# Altium schematic sheet BoardInterfaces_Soldier.SchDoc
size Tabloid; SheetNumber: 2; SheetTotal: 6
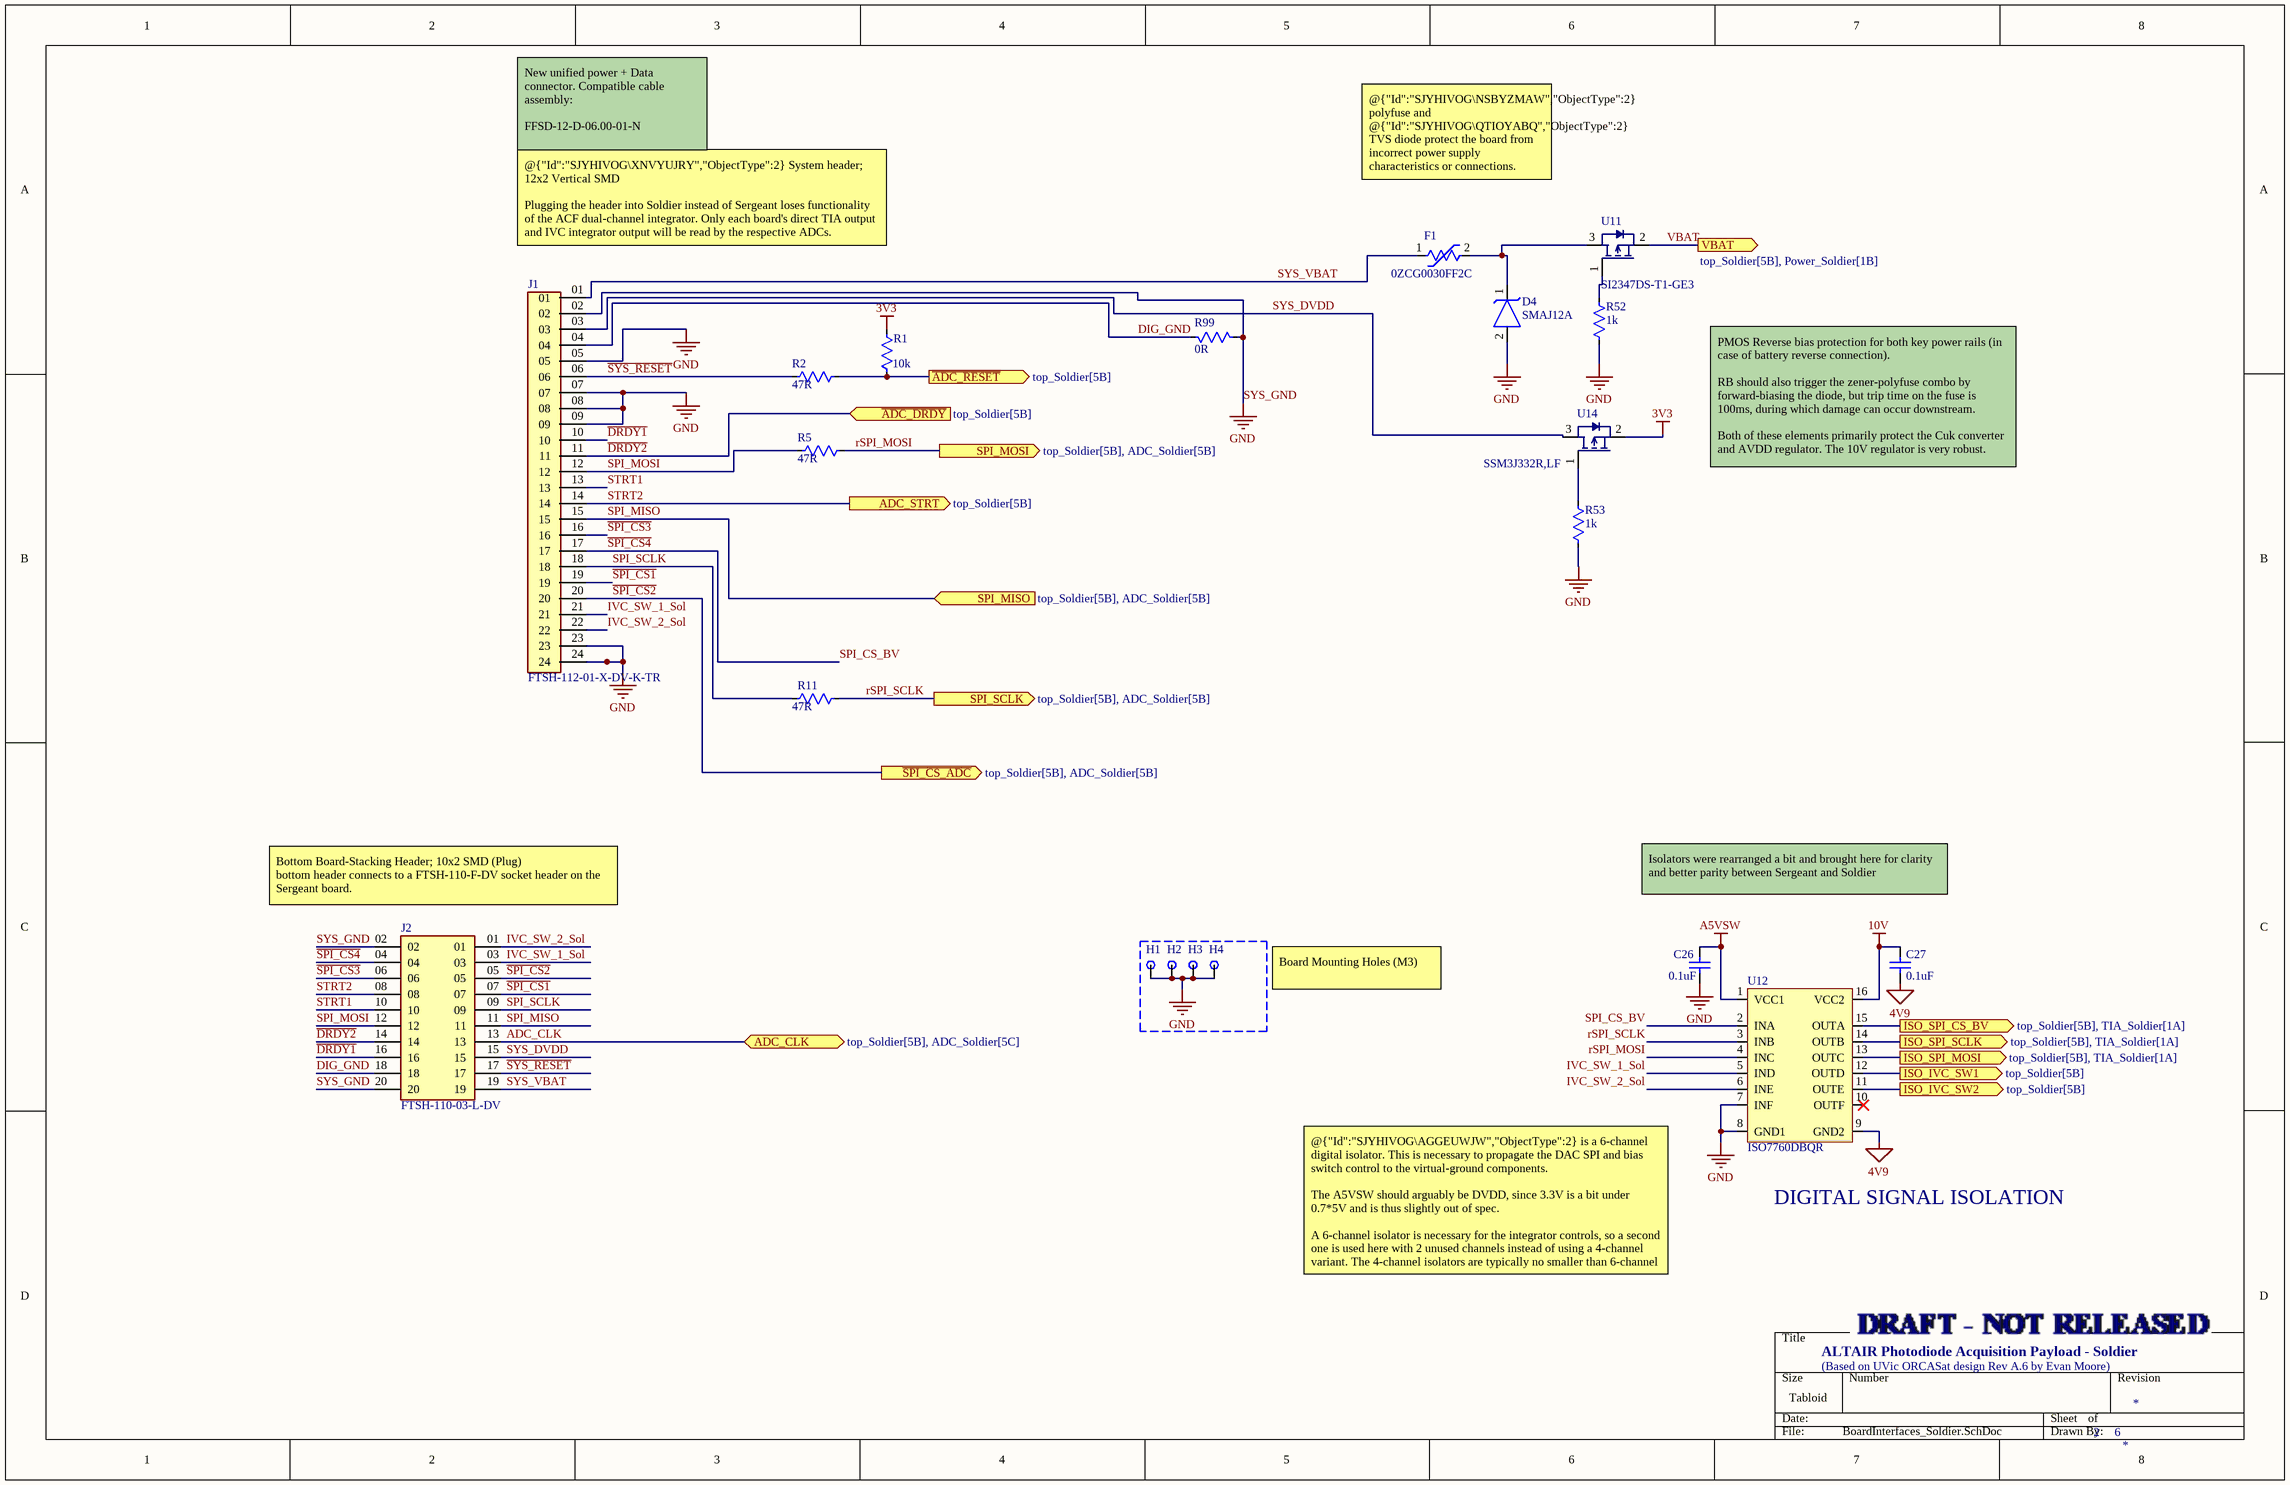
[diagram p0: BoardInterfaces_Soldier.SchDoc]

## Parts
C26  0.1uF  [CAP 0603 IPC MID DENSITY]
C27  0.1uF  [CAP 0603 IPC MID DENSITY]
D4  SMAJ12A  [DO-214AC SMA VISHAY]
F1  0ZCG0030FF2C  [POLYFUSE 1812 NON-IPC BELFUSE]
H1  Mount-hole  [M3 PTH FOR 4.5MM HEX]  (value not drawn)  (no BOM)
H2  Mount-hole  [M3 PTH FOR 4.5MM HEX]  (value not drawn)  (no BOM)
H3  Mount-hole  [M3 PTH FOR 4.5MM HEX]  (value not drawn)  (no BOM)
H4  Mount-hole  [M3 PTH FOR 4.5MM HEX]  (value not drawn)  (no BOM)
J1  FTSH-112-01-X-DV-K-TR  [SAMTEC_FTSH-112-01-X-DV-K-TR]
J2  FTSH-110-03-L-DV  [HEADER MALE 10X2 1.27MM PITCH FTSH]
R1  10k  [RES 0603 IPC MID DENSITY]
R2  47R  [RES 0402 NON-IPC SEI]
R5  47R  [RES 0402 NON-IPC SEI]
R11  47R  [RES 0402 NON-IPC SEI]
R52  1k  [RES 0603 IPC MID DENSITY]
R53  1k  [RES 0603 IPC MID DENSITY]
R99  0R  [RES 0402 IPC MID DENSITY]
U11  SI2347DS-T1-GE3  [SOT95P245X110-3N]
U12  ISO7760DBQR  [16-SSOP 0.635MM PITCH 5.4MM WIDTH NON-IPC TI]
U14  SSM3J332R,LF  [SOT95P245X110-3N]

## Ports
ADC_CLK (bidir, see top_Soldier[5B], ADC_Soldier[5C]), ADC_STRT (out, see top_Soldier[5B]), ISO_IVC_SW1 (out, see top_Soldier[5B]), ISO_IVC_SW2 (out, see top_Soldier[5B]), ISO_SPI_CS_BV (out, see top_Soldier[5B], TIA_Soldier[1A]), ISO_SPI_MOSI (out, see top_Soldier[5B], TIA_Soldier[1A]), ISO_SPI_SCLK (out, see top_Soldier[5B], TIA_Soldier[1A]), SPI_MISO (in, see top_Soldier[5B], ADC_Soldier[5B]), SPI_MOSI (out, see top_Soldier[5B], ADC_Soldier[5B]), SPI_SCLK (out, see top_Soldier[5B], ADC_Soldier[5B]), VBAT (out, see top_Soldier[5B], Power_Soldier[1B]), ~{ADC_DRDY} (in, see top_Soldier[5B]), ~{ADC_RESET} (out, see top_Soldier[5B]), ~{SPI_CS_ADC} (out, see top_Soldier[5B], ADC_Soldier[5B])

## Nets
3V3: R1.1 U14.2(Source)
4V9: C27.1 U12.9(GND2)
10V: C27.2 U12.16(VCC2)
A5VSW: C26.2 U12.1(VCC1)
SYS_GND: C26.1 D4.2(Anode) H1.1 H2.1 H3.1 H4.1 J1.02 J1.05 J1.07 J1.08 J1.09 J1.23 J1.24 J2.02 J2.20 R52.1 R53.1 R99.1 U12.7(INF) U12.8(GND1)  [also labelled GND]
~{ADC_RESET}: R1.2 R2.2 ; port ~{ADC_RESET}
~{DRDY1}: J1.10 J2.16
~{DRDY2}: J1.11 J2.14 ; port ~{ADC_DRDY}
~{SPI_CS1}: J1.19 J2.07
~{SPI_CS2}: J1.20 J2.05 ; port ~{SPI_CS_ADC}
~{SPI_CS3}: J1.16 J2.06
~{SPI_CS4}: J1.17 J2.04 U12.2(INA)  [also labelled SPI_CS_BV]
~{SYS_RESET}: J1.06 J2.17 R2.1
ADC_CLK: J2.13 ; port ADC_CLK
DIG_GND: J1.04 J2.18 R99.2
ISO_IVC_SW1: U12.12(OUTD) ; port ISO_IVC_SW1
ISO_IVC_SW2: U12.11(OUTE) ; port ISO_IVC_SW2
ISO_SPI_CS_BV: U12.15(OUTA) ; port ISO_SPI_CS_BV
ISO_SPI_MOSI: U12.13(OUTC) ; port ISO_SPI_MOSI
ISO_SPI_SCLK: U12.14(OUTB) ; port ISO_SPI_SCLK
IVC_SW_1_Sol: J1.21 J2.03 U12.5(IND)
IVC_SW_2_Sol: J1.22 J2.01 U12.6(INE)
rSPI_MOSI: R5.2 U12.4(INC) ; port SPI_MOSI
rSPI_SCLK: R11.2 U12.3(INB) ; port SPI_SCLK
SPI_MISO: J1.15 J2.11 ; port SPI_MISO
SPI_MOSI: J1.12 J2.12 R5.1
SPI_SCLK: J1.18 J2.09 R11.1
STRT1: J1.13 J2.10
STRT2: J1.14 J2.08 ; port ADC_STRT
SYS_DVDD: J1.03 J2.15 U14.3(Drain)
SYS_VBAT: F1.1 J1.01 J2.19
VBAT: U11.2(Source) ; port VBAT
NetD4_1: D4.1(Cathode) F1.2 U11.3(Drain)
NetR52_2: R52.2 U11.1(Gate)
NetR53_2: R53.2 U14.1(Gate)

Not connected (* = marked no-connect by the designer): U12 10(OUTF)*

## Notes on the sheet
- New unified power + Data connector. Compatible cable assembly:
  FFSD-12-D-06.00-01-N
- @{"Id":"SJYHIVOG\NSBYZMAW","ObjectType":2} polyfuse and @{"Id":"SJYHIVOG\QTIOYABQ","ObjectType":2} TVS diode protect the board from incorrect power supply characteristics or connections.
  Rated for up to 14V and 300mA.
- (near J1) @{"Id":"SJYHIVOG\XNVYUJRY","ObjectType":2} System header; 12x2 Vertical SMD
  Plugging the header into Soldier instead of Sergeant loses functionality of the ACF dual-channel integrator. Only each board's direct TIA output and IVC integrator output will be read by the respective ADCs.
- PMOS Reverse bias protection for both key power rails (in case of battery reverse connection).
  RB should also trigger the zener-polyfuse combo by forward-biasing the diode, but trip time on the fuse is 100ms, during which damage can occur downstream.
  Both of these elements primarily protect the Cuk converter and AVDD regulator. The 10V regulator is very robust.
- (near J2) Bottom Board-Stacking Header; 10x2 SMD (Plug)
  bottom header connects to a FTSH-110-F-DV socket header on the Sergeant board.
- Isolators were rearranged a bit and brought here for clarity and better parity between Sergeant and Soldier
- Board Mounting Holes (M3)
- DIGITAL SIGNAL ISOLATION
- @{"Id":"SJYHIVOG\AGGEUWJW","ObjectType":2} is a 6-channel digital isolator. This is necessary to propagate the DAC SPI and bias switch control to the virtual-ground components.
  The A5VSW should arguably be DVDD, since 3.3V is a bit under 0.7*5V and is thus slightly out of spec.
  A 6-channel isolator is necessary for the integrator controls, so a second one is used here with 2 unused channels instead of using a 4-channel variant. The 4-channel isolators are typically no smaller than 6-channel isolators.
- ALTAIR Photodiode Acquisition Payload - Soldier
- (Based on UVic ORCASat design Rev A.6 by Evan Moore)

## Library data of the parts
C26 C27 = CAP: Kemet C0603C104K5RACAUTO - Cap Ceramic 0.1uF 50V X7R 10% 0603 125C Paper T/R; MF: Kemet; MP: C0603C104K5RACAUTO
D4 = Zener: Vishay SMAJ12A-M3/61 - TVS Diode 12V Standoff 13.3V Breakdown DO-214AC; MF: Vishay General Semiconductor; MP: SMAJ12A-M3/61
F1 = Polyfuse: Bel Fuse 0ZCG0030FF2C - Polymeric PTC Resettable Fuse 30V 300mA hold 600mA trip SMD 1812; MF: Bel Fuse Inc.; MP: 0ZCG0030FF2C
H1-H4 = Mount-hole: (Plated) Mounting hole
J1 = FTSH-112-01-X-DV-K-TR: MF: {'manufacturer': u'Samtec'}; Package: None; Price: None; Value: *; MP: FTSH-112-01-X-DV-K-TR; Availability: Unavailable
J2 = CLP-110-02-X-D: 10x2 Position Pin Connector 0.050 (1.27mm) Surface Mount, Gold; Alt parts FTSH-110-03-F-DV (thinner gold), FTSH-110-03-F-DV-P (thinner gold + pick and place); MF: Samtec; MP: FTSH-110-03-L-DV
R1 = RES: Vishay CRCW060310K0FKEA SMD 0603 10k, CRCW e3 Series, 75V, thick film, 100mW; MF: Vishay Dale; MP: CRCW060310K0FKEA
R2 R5 R11 = RES: Stackpole RMCF0402JT47R0 - Res 47Ohm 5% 0.063W 0402 Thick Film AEC-Q200 compliant; MF: Stackpole Electronics Inc.; MP: RMCF0402JT47R0
R52 R53 = RES: Panasonic ERJ-U03F1001V - Res SMD 1 kOhm 1% 1/10W 0603; MF: Panasonic; MP: ERJ-U03F1001V
R99 = RES: Yageo RC0402JR-070RL - Res 0 Ohms 1/16W SMD 0402; MF: YAGEO; MP: RC0402JR-070RL
U11 = PMOS: MOSFET P-CH 30V 5A SOT23-3; Supplier 1: Avnet; Supplier Part Number 1: SI2347DS-T1-GE3
U12 = ISO7760DBQR: Digital Isolator 6-Channel 6/0 Inputs 16SSOP; MF: Texas Instruments; MP: ISO7760DBQR
U14 = PMOS_LV: P-Channel 30 V 6A (Ta) 1W (Ta) Surface Mount SOT-23F; Supplier 1: Avnet; Supplier Part Number 1: SI2347DS-T1-GE3